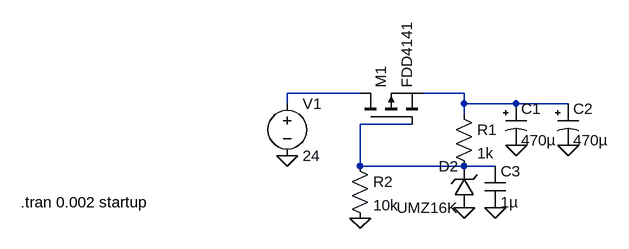
[diagram p0: schematic inrush_limit.asc]
inrush_limit.asc, the LTspice schematic file:
Version 4
SHEET 1 880 680
WIRE -16 144 -128 144
WIRE 144 144 80 144
WIRE -128 160 -128 144
WIRE 144 160 144 144
WIRE 224 160 144 160
WIRE 304 160 224 160
WIRE 144 176 144 160
WIRE 64 192 -16 192
WIRE -16 256 -16 192
WIRE 144 256 -16 256
WIRE 192 256 144 256
FLAG 224 224 0
FLAG 304 224 0
FLAG -128 240 0
FLAG 192 320 0
FLAG 144 320 0
FLAG -16 336 0
SYMBOL polcap 208 160 R0
WINDOW 3 24 56 Left 2
SYMATTR InstName C1
SYMATTR Value 470µ
SYMATTR Description Capacitor
SYMATTR Type cap
SYMATTR SpiceLine V=50 Irms=1.44 Rser=0.07 Lser=0 mfg="Panasonic" pn="ECA1HFQ471" type="Al electrolytic"
SYMBOL polcap 288 160 R0
WINDOW 3 24 56 Left 2
SYMATTR InstName C2
SYMATTR Value 470µ
SYMATTR Description Capacitor
SYMATTR Type cap
SYMATTR SpiceLine V=50 Irms=1.44 Rser=0.07 Lser=0 mfg="Panasonic" pn="ECA1HFQ471" type="Al electrolytic"
SYMBOL pmos -16 192 R270
SYMATTR InstName M1
SYMATTR Value FDD4141
SYMBOL voltage -128 144 R0
WINDOW 123 0 0 Left 0
WINDOW 39 0 0 Left 0
SYMATTR InstName V1
SYMATTR Value 24
SYMBOL zener 160 320 R180
WINDOW 0 24 64 Left 2
WINDOW 3 24 0 Left 2
SYMATTR InstName D2
SYMATTR Value UMZ16K
SYMBOL res 128 160 R0
SYMATTR InstName R1
SYMATTR Value 1k
SYMBOL cap 176 256 R0
SYMATTR InstName C3
SYMATTR Value 1µ
SYMBOL res -32 240 R0
SYMATTR InstName R2
SYMATTR Value 10k
TEXT -538 312 Left 2 !.tran 0.002 startup

The netlist it stands for:
* inrush_limit.asc
C1 N002 0 470µ V=50 Irms=1.44 Rser=0.07 Lser=0 mfg="Panasonic" pn="ECA1HFQ471" type="Al electrolytic"
C2 N002 0 470µ V=50 Irms=1.44 Rser=0.07 Lser=0 mfg="Panasonic" pn="ECA1HFQ471" type="Al electrolytic"
M1 N001 N003 N002 N002 FDD4141
V1 N001 0 24
D2 0 N003 UMZ16K
R1 N002 N003 1k
C3 N003 0 1µ
R2 N003 0 10k
.model D D
.lib standard.dio
.model NMOS NMOS
.model PMOS PMOS
.lib standard.mos
.tran 0.002 startup
.backanno
.end